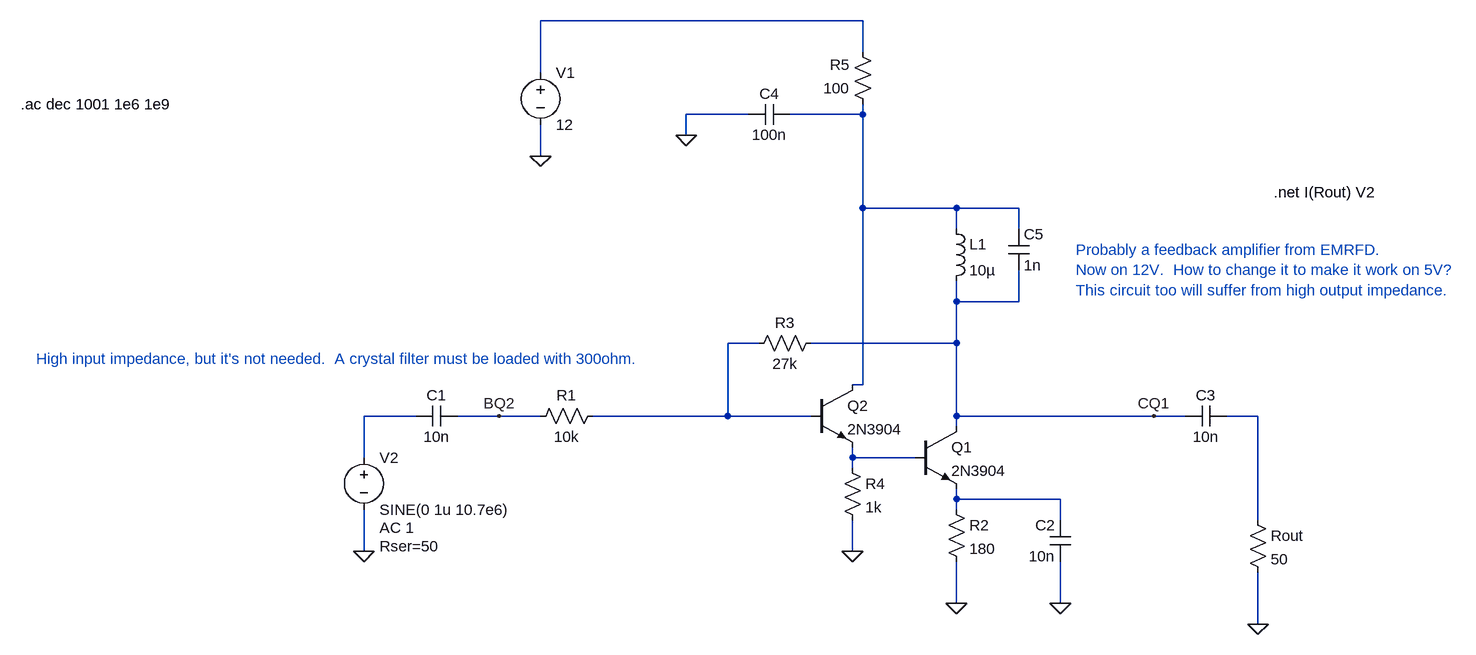
[diagram p0: schematic IF2.asc]
IF2.asc, the LTspice schematic file:
Version 4
SHEET 1 1464 680
WIRE 496 -368 0 -368
WIRE 496 -320 496 -368
WIRE 0 -288 0 -368
WIRE 320 -224 224 -224
WIRE 496 -224 496 -240
WIRE 496 -224 384 -224
WIRE 224 -192 224 -224
WIRE 0 -160 0 -208
WIRE 496 -80 496 -224
WIRE 640 -80 496 -80
WIRE 736 -80 640 -80
WIRE 640 -48 640 -80
WIRE 736 -48 736 -80
WIRE 640 64 640 32
WIRE 736 64 736 16
WIRE 736 64 640 64
WIRE 336 128 288 128
WIRE 640 128 640 64
WIRE 640 128 416 128
WIRE 496 192 496 -80
WIRE 496 192 480 192
WIRE -192 240 -272 240
WIRE -64 240 -128 240
WIRE 0 240 -64 240
WIRE 288 240 288 128
WIRE 288 240 80 240
WIRE 416 240 288 240
WIRE 640 240 640 128
WIRE 944 240 640 240
WIRE 992 240 944 240
WIRE 1104 240 1056 240
WIRE 640 256 640 240
WIRE -272 304 -272 240
WIRE 480 304 480 288
WIRE 576 304 480 304
WIRE 480 320 480 304
WIRE 640 368 640 352
WIRE 800 368 640 368
WIRE 640 384 640 368
WIRE 800 400 800 368
WIRE 1104 400 1104 240
WIRE -272 448 -272 384
WIRE 480 448 480 400
WIRE 640 528 640 464
WIRE 800 528 800 464
WIRE 1104 560 1104 480
FLAG 0 -160 0
FLAG 480 448 0
FLAG -272 448 0
FLAG -64 240 BQ2
FLAG 944 240 CQ1
FLAG 1104 560 0
FLAG 640 528 0
FLAG 800 528 0
FLAG 224 -192 0
SYMBOL npn 576 256 R0
SYMATTR InstName Q1
SYMATTR Value 2N3904
SYMBOL npn 416 192 R0
SYMATTR InstName Q2
SYMATTR Value 2N3904
SYMBOL res 624 368 R0
SYMATTR InstName R2
SYMATTR Value 180
SYMBOL res 464 304 R0
SYMATTR InstName R4
SYMATTR Value 1k
SYMBOL cap -128 224 R90
WINDOW 0 0 32 VBottom 2
WINDOW 3 32 32 VTop 2
SYMATTR InstName C1
SYMATTR Value 10n
SYMBOL voltage 0 -304 R0
WINDOW 123 0 0 Left 0
WINDOW 39 0 0 Left 0
SYMATTR InstName V1
SYMATTR Value 12
SYMBOL voltage -272 288 R0
WINDOW 123 24 124 Left 2
WINDOW 39 24 152 Left 2
SYMATTR Value2 AC 1
SYMATTR SpiceLine Rser=50
SYMATTR InstName V2
SYMATTR Value SINE(0 1u 10.7e6)
SYMBOL cap 816 464 R180
WINDOW 0 24 56 Left 2
WINDOW 3 24 8 Left 2
SYMATTR InstName C2
SYMATTR Value 10n
SYMBOL res 1088 384 R0
SYMATTR InstName Rout
SYMATTR Value 50
SYMBOL cap 1056 224 R90
WINDOW 0 0 32 VBottom 2
WINDOW 3 32 32 VTop 2
SYMATTR InstName C3
SYMATTR Value 10n
SYMBOL res 96 224 R90
WINDOW 0 0 56 VBottom 2
WINDOW 3 32 56 VTop 2
SYMATTR InstName R1
SYMATTR Value 10k
SYMBOL res 432 112 R90
WINDOW 0 0 56 VBottom 2
WINDOW 3 32 56 VTop 2
SYMATTR InstName R3
SYMATTR Value 27k
SYMBOL res 512 -224 R180
WINDOW 0 36 76 Left 2
WINDOW 3 36 40 Left 2
SYMATTR InstName R5
SYMATTR Value 100
SYMBOL cap 384 -240 R90
WINDOW 0 0 32 VBottom 2
WINDOW 3 32 32 VTop 2
SYMATTR InstName C4
SYMATTR Value 100n
SYMBOL ind 624 -64 R0
SYMATTR InstName L1
SYMATTR Value 10µ
SYMBOL cap 720 -48 R0
SYMATTR InstName C5
SYMATTR Value 1n
TEXT 1128 -104 Left 2 !.net I(Rout) V2
TEXT -800 -240 Left 2 !.ac dec 1001 1e6 1e9
TEXT 824 -16 Left 2 ;Probably a feedback amplifier from EMRFD.  \nNow on 12V.  How to change it to make it work on 5V?\nThis circuit too will suffer from high output impedance.
TEXT -776 152 Left 2 ;High input impedance, but it's not needed.  A crystal filter must be loaded with 300ohm.

The netlist it stands for:
* IF2.asc
Q1 CQ1 N006 N007 0 2N3904
Q2 N002 N003 N006 0 2N3904
R2 N007 0 180
R4 N006 0 1k
C1 BQ2 N004 10n
V1 N001 0 12
V2 N004 0 SINE(0 1u 10.7e6) AC 1 Rser=50
C2 0 N007 10n
Rout N005 0 50
C3 N005 CQ1 10n
R1 N003 BQ2 10k
R3 CQ1 N003 27k
R5 N002 N001 100
C4 N002 0 100n
L1 N002 CQ1 10µ
C5 N002 CQ1 1n
.model NPN NPN
.model PNP PNP
.lib standard.bjt
.net I(Rout) V2
.ac dec 1001 1e6 1e9
* Probably a feedback amplifier from EMRFD.
* Now on 12V.  How to change it to make it work on 5V?
* This circuit too will suffer from high output impedance.
* High input impedance, but it's not needed.  A crystal filter must be loaded with 300ohm.
.backanno
.end